# EAGLE design TwiddleStick (EAGLE 9.6.2)
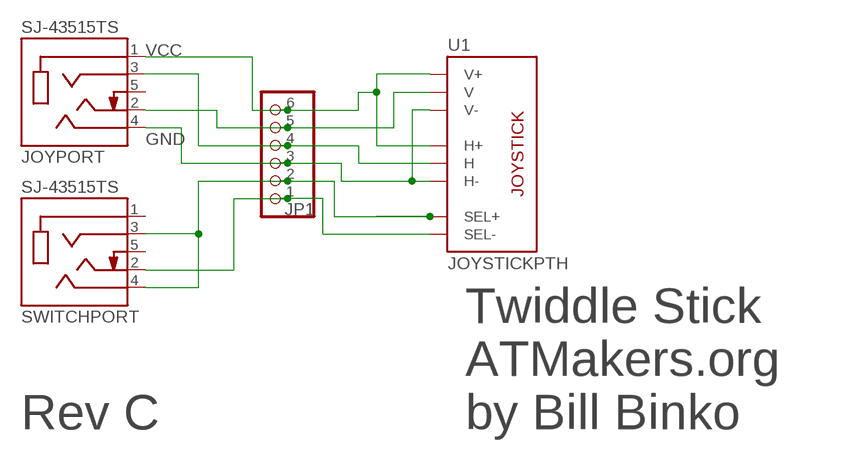
[diagram p0: schematic, sheet 1]

## Parts
JOYPORT  SJ-43515TS  [CUI_SJ-43515TS]
JP1  PINHD-1X6B  [1X06-BIG]
SWITCHPORT  SJ-43515TS  [CUI_SJ-43515TS]
U1  JOYSTICKPTH  [JOYSTICK]

## Nets
GND: JOYPORT.4(RING2) JP1.3 U1.H3(H-) U1.V3(V-)
N$1: JP1.2 SWITCHPORT.3(RING1) SWITCHPORT.4(RING2) U1.B1A(SEL+)
N$3: JOYPORT.2(TIP) JP1.5 U1.V2(V)
N$4: JOYPORT.3(RING1) JP1.4 U1.H2(H)
N$6: JP1.1 SWITCHPORT.2(TIP) U1.B2A(SEL-)
VCC: JOYPORT.1(SLEEVE) JP1.6 U1.H1(H+) U1.V1(V+)
Unconnected: JOYPORT.5(TIP_SWITCH) SWITCHPORT.1(SLEEVE) SWITCHPORT.5(TIP_SWITCH)

## Notes on the sheet
- Rev C
- Twiddle Stick
  ATMakers.org
  by Bill Binko

## Library data of the parts
JOYPORT SWITCHPORT = ATMakers:SJ-43515TS: 4 Conductor PCB Mount Low Profile 3.5 mm Audio Jack; AVAILABILITY: Unavailable; CUI_PURCHASE_URL: https://www.cuidevices.com/product/interconnect/connectors/audio-connectors/jacks/sj-4351x-series?utm_source=snapeda.com&utm_medium=referral&utm_campaign=snapedaBOM; DESCRIPTION: 3.5 mm, 4 Conductors, Right Angle, Through Hole, Audio Jack Connector; MF: CUI Devices; MP: SJ-43515TS; PACKAGE: None; PRICE: None
JP1 = adafruit:PINHD-1X6: PIN HEADER
U1 = adafruit:JOYSTICK: Thumb Joystick Joystick commonly found in PS2 controllers. Two pots and a select switch. Adapted from Sparkfun Library (but for more common 6mm switch sticks)

## Board
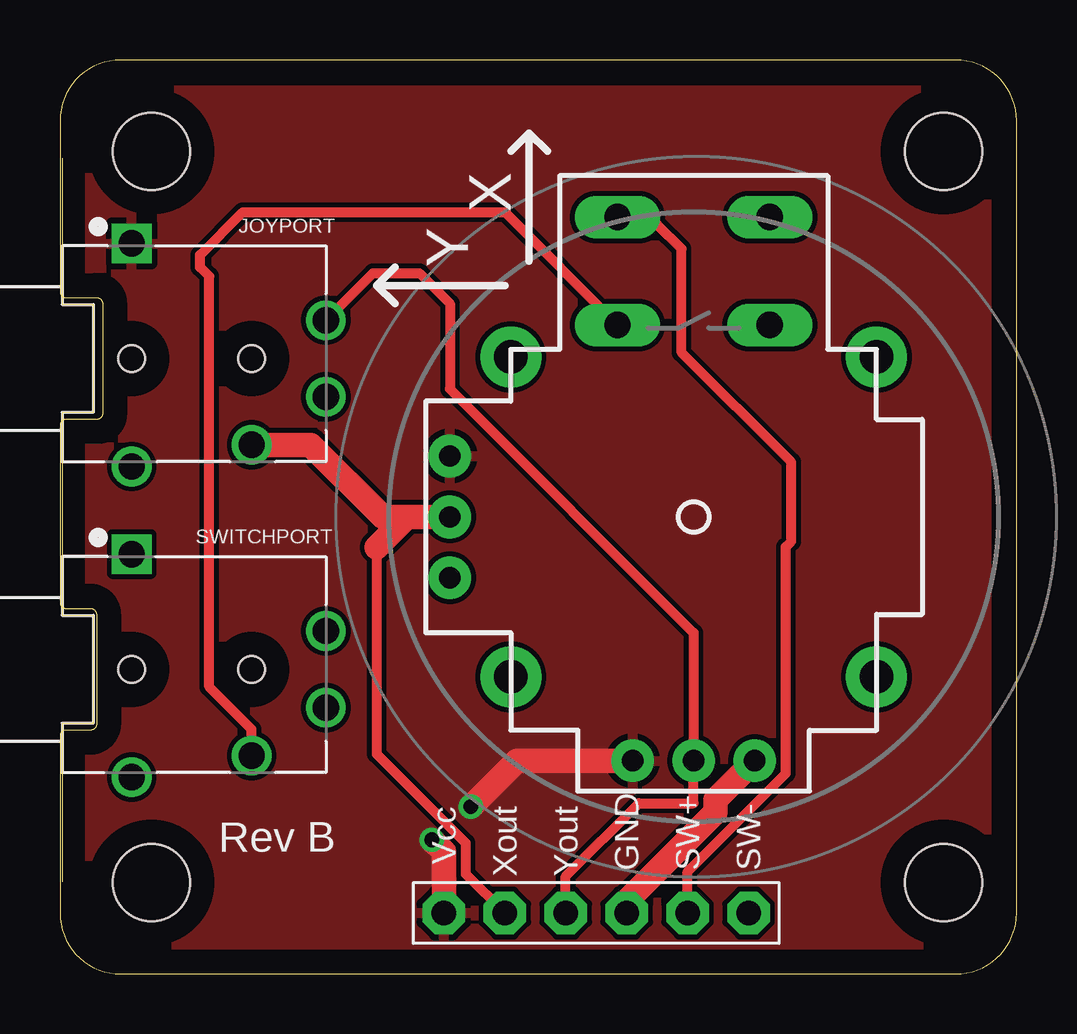
[diagram p1: board, top side]
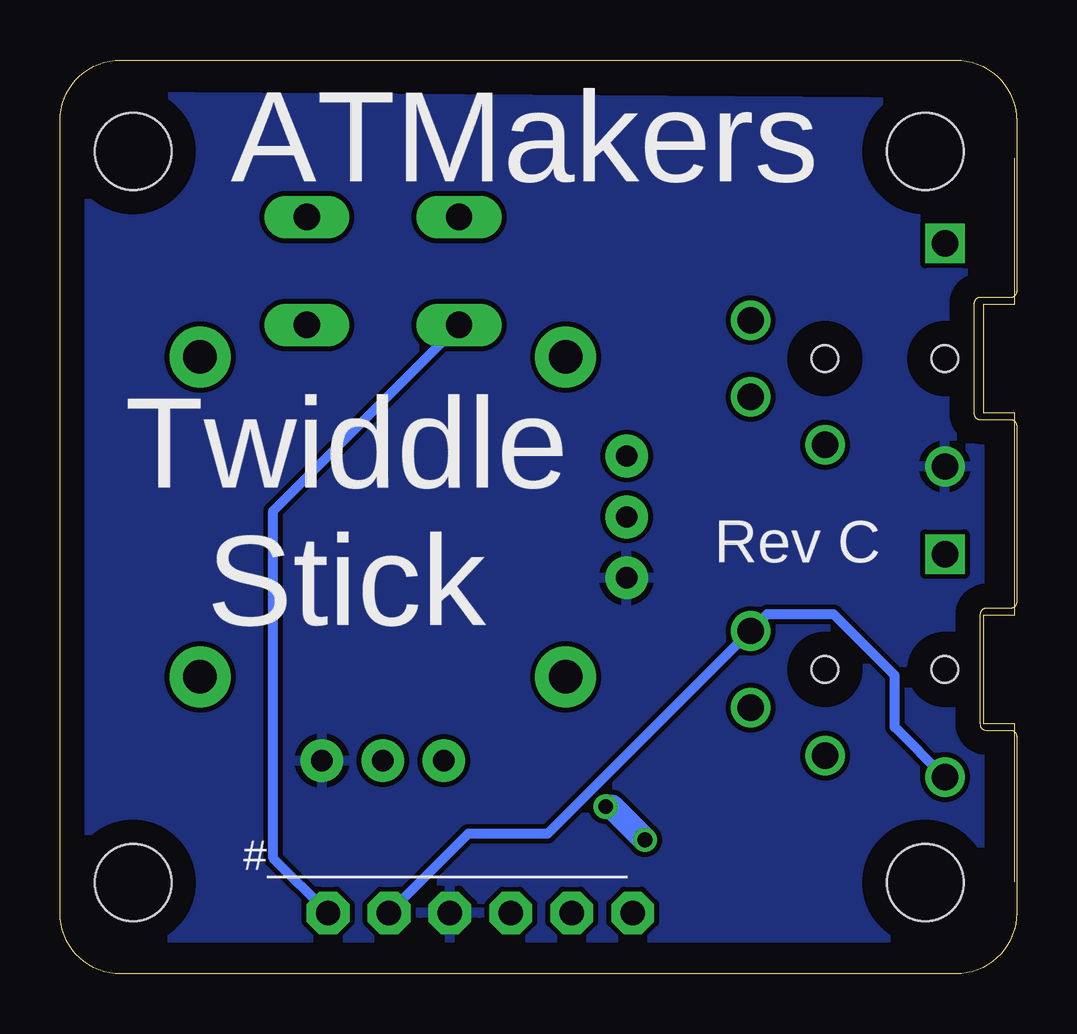
[diagram p2: board, bottom side, seen from below]

Size 39.88 x 38.1 mm. Coordinates in mm from the lower left corner, seen from the top.
Outline: 37.34,38.1 2.54,38.1 arc90 0,35.56 0,28.45 arc90 0.25,28.19 1.52,28.19 arc-90 1.78,27.94 1.78,23.37 arc-90 1.52,23.11 0.25,23.11 arc90 0,22.86 0,15.49 arc90 0.25,15.24 1.27,15.24 arc-90 1.52,14.99 1.52,10.41 arc-90 1.27,10.16 0.25,10.16 arc90 0,9.91 0,2.54 arc90 2.54,0 37.34,0 arc90 39.88,2.54 39.88,35.56 arc90 37.34,38.1
Copper layers (1*16): Top 0.035mm / dielectric 1.5mm / Bottom 0.035mm
Design rules "default *": minimum track width 10mil, minimum drill 24mil, track to track 8mil, track to pad 8mil, pad to pad 8mil, via to via 8mil, smd to smd 8mil, copper to edge 40mil, drill to drill 8mil, minimum pad ring 10mil, minimum via ring 8mil, stop-mask expansion 4mil, vias tented up to drill 25mil, thermal gap 10mil
Holes 3.2 mm at 3.81,3.81 3.81,34.29 36.83,34.29 36.83,3.81

### Footprints (pad centres in the part's own frame; a part is rotated, then mirrored left to right if it is on the bottom)
CUI_SJ-43515TS = drill 1.1 square: 1 -2.6,4.8 | drill 1.1: 2 2.4,-3.6; 3 5.5,1.6; 4 -2.6,-4.5; 5 5.5,-1.6 | hole 1.1: -2.6,0; 2.4,0
1X06-BIG = drill 1.016 pad 1.778 octagon: 1 -6.35,0; 2 -3.81,0; 3 -1.27,0; 4 1.27,0; 5 3.81,0; 6 6.35,0
JOYSTICK = drill 1.1 pad 1.778 long: B1A -3.175,12.501; B1B 3.175,12.501; B2A -3.175,8.001; B2B 3.175,8.001 | drill 0.889 pad 1.778: H1 -2.54,-10.16; H2 0,-10.16; H3 2.54,-10.16; V1 -10.16,2.54; V2 -10.16,0; V3 -10.16,-2.54 | drill 1.397 pad 2.54: MOUNT1 -7.62,6.668; MOUNT2 -7.62,-6.668; MOUNT3 7.62,-6.668; MOUNT4 7.62,6.668

### Placement (x,y rotation side)
JOYPORT  5.59,25.65 0 top
JP1  22.35,2.54 180 top
SWITCHPORT  5.59,12.7 0 top
U1  26.42,19.05 0 top

### Tracks (layer width: path | path; a pad name or v marks a point on that pad's centre or on a via)
GND
  Top 1.016: U1.H3 27.33,7.26 27.33,6.73 25.03,4.43 23.62,3.02 JP1.3
  pour Bottom: 37.08,36.58 38.86,34.8 38.86,2.79 37.59,1.52 1.52,1.52 1.52,34.54 3.3,36.32
N$1
  Top 0.406: JP1.2 26.16,4.26 30.25,8.35 30.25,17.8 30.48,18.03 30.48,21.34 25.91,25.91 25.91,30.23 24.89,31.24 22.35,31.24 22.66,31.55 U1.B1A
  Bottom 0.406: SWITCHPORT.4 5.08,10.29 5.08,12.45 7.62,14.99 10.4,14.99 SWITCHPORT.3 19.55,5.84 22.86,5.84 JP1.2
N$3
  Top 0.406: JP1.5 16.92,4.17 16.92,5.46 13.21,9.17 13.21,17.78
  Top 1.016: JOYPORT.2 10.46,22.05 13.46,19.05 U1.V2 14.48,19.05 13.21,17.78
N$4
  Top 0.406: JP1.4 21.08,4.06 24.13,7.11 26.42,7.11 U1.H2 26.42,14.22 16.26,24.38 16.26,27.94 14.99,29.21 13.04,29.21 JOYPORT.3
N$6
  Top 0.406: SWITCHPORT.2 7.99,10.2 6.22,11.97 6.22,29.09 5.84,29.46 5.84,29.97 7.62,31.75 18.54,31.75 U1.B2A
  Bottom 0.406: JP1.1 30.99,4.83 30.99,19.3 U1.B2A
VCC  (via drill 0.61)
  Top 1.016: JP1.6 16,5.08 v15.49,5.59 | v17.13,6.97 19.05,8.89 U1.H1
  Bottom 1.016: v15.49,5.59 16.87,6.97 v17.13,6.97
  pour Top: 37.85,36.83 38.61,36.07 38.61,2.54 37.08,1.02 35.31,1.02 35.05,0.76 3.81,0.76 1.02,3.56 1.02,3.81 1.27,36.83

### Text on the board
tPlace: X | Y | Rev B | Vcc | Xout | Yout | GND | SW+ | SW-
bNames: ATMakers | Twiddle / Stick | Rev C | #_______________